# EAGLE design synth-zodiac-cancer-cv-panel (EAGLE 9.6.2)
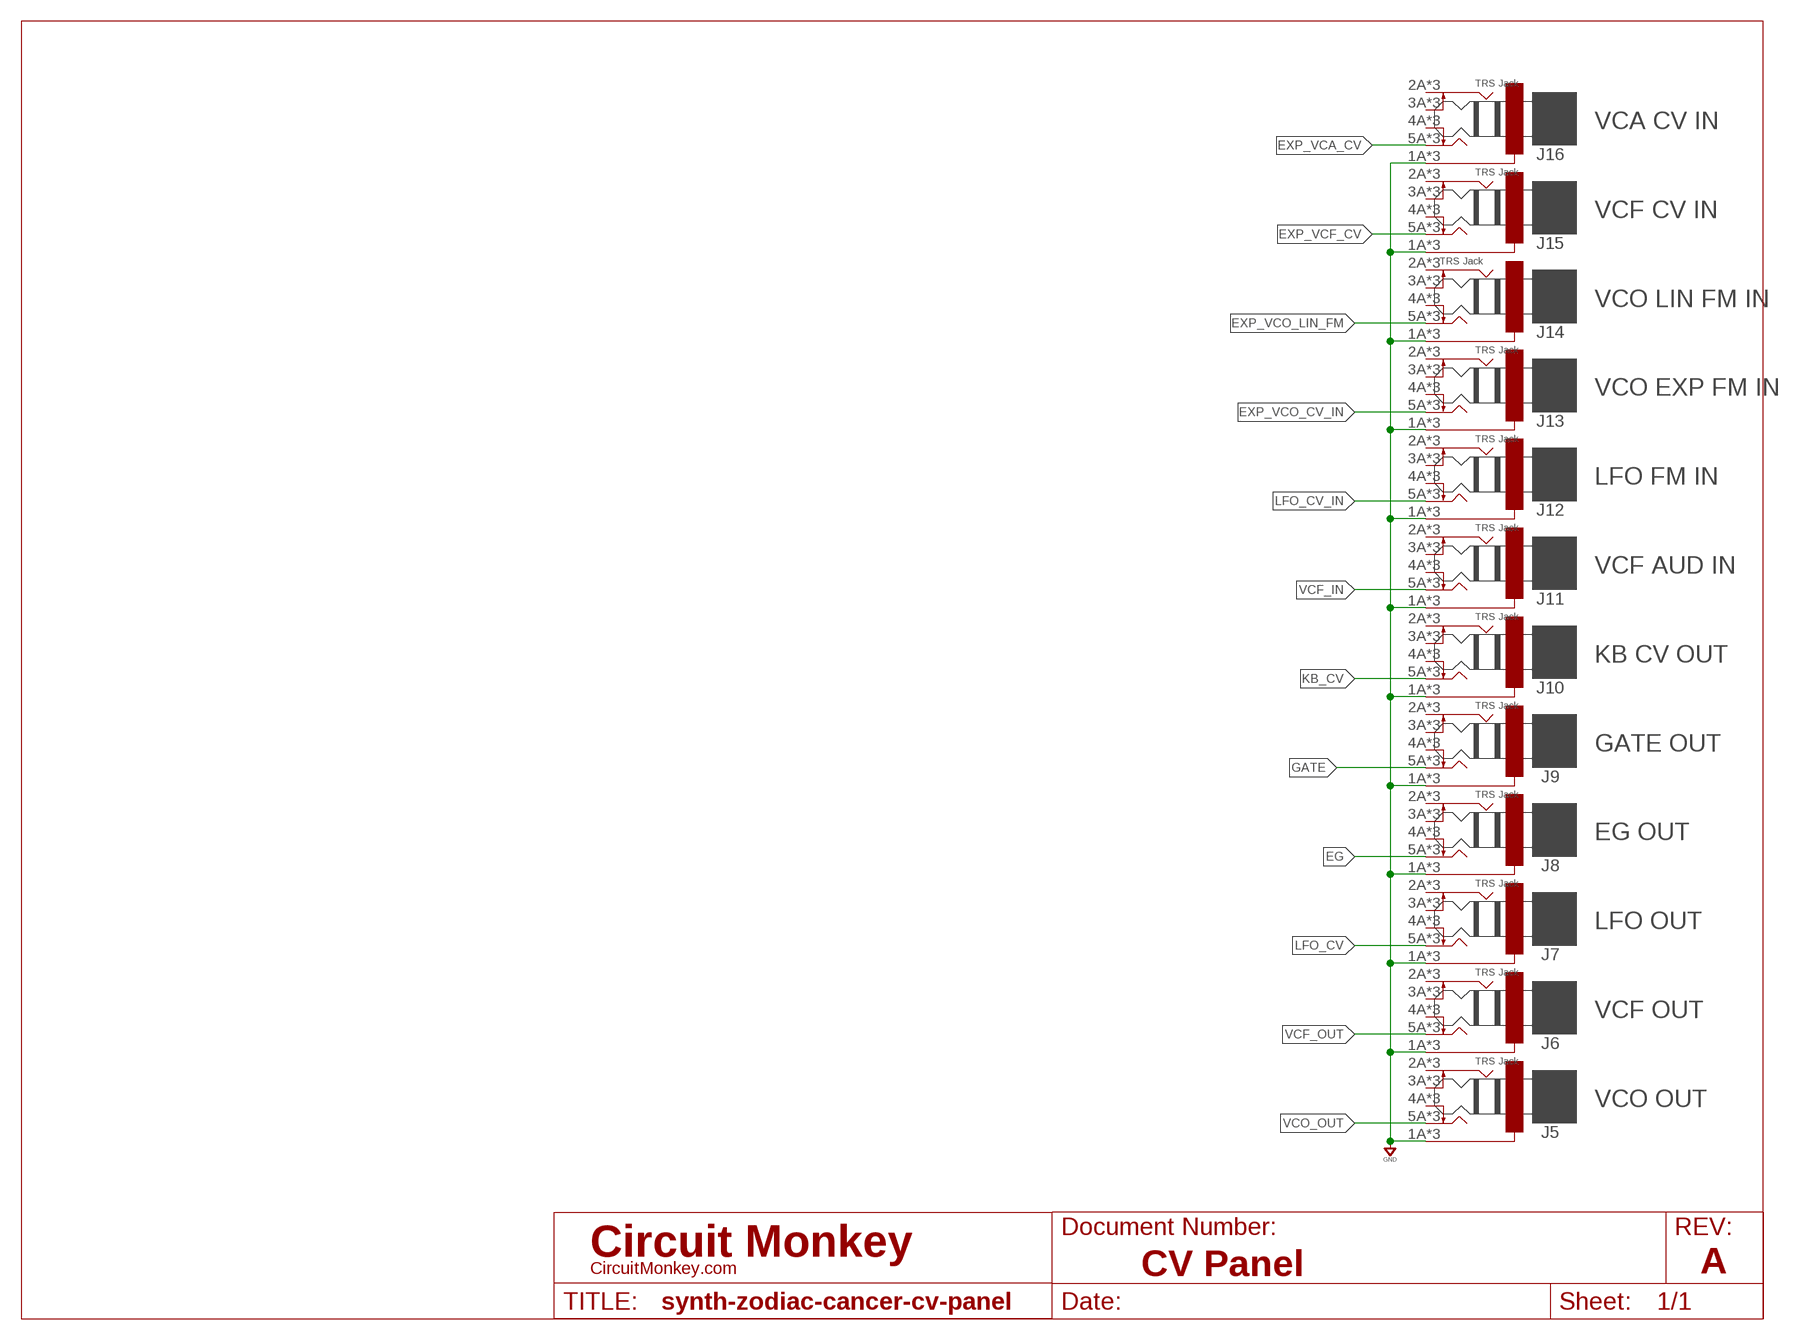
[diagram p0: schematic, sheet 1]
SHEET5 (LETTER_L-CIRCUITMONKEY): DOCUMENT_NUMBER: CV Panel; REV: A

## Parts
J5  TRS Jack  TRS-JACK-STEREOPJ-324  [PJ-324]
J6  TRS Jack  TRS-JACK-STEREOPJ-324  [PJ-324]
J7  TRS Jack  TRS-JACK-STEREOPJ-324  [PJ-324]
J8  TRS Jack  TRS-JACK-STEREOPJ-324  [PJ-324]
J9  TRS Jack  TRS-JACK-STEREOPJ-324  [PJ-324]
J10  TRS Jack  TRS-JACK-STEREOPJ-324  [PJ-324]
J11  TRS Jack  TRS-JACK-STEREOPJ-324  [PJ-324]
J12  TRS Jack  TRS-JACK-STEREOPJ-324  [PJ-324]
J13  TRS Jack  TRS-JACK-STEREOPJ-324  [PJ-324]
J14  TRS Jack  TRS-JACK-STEREOPJ-324  [PJ-324]
J15  TRS Jack  TRS-JACK-STEREOPJ-324  [PJ-324]
J16  TRS Jack  TRS-JACK-STEREOPJ-324  [PJ-324]

## Nets
EG: J8.5A1(T) J8.5A2(T) J8.5A(T)
EXP_VCA_CV: J16.5A1(T) J16.5A2(T) J16.5A(T)
EXP_VCF_CV: J15.5A1(T) J15.5A2(T) J15.5A(T)
EXP_VCO_CV_IN: J13.5A1(T) J13.5A2(T) J13.5A(T)
EXP_VCO_LIN_FM: J14.5A1(T) J14.5A2(T) J14.5A(T)
GATE: J9.5A1(T) J9.5A2(T) J9.5A(T)
GND: J5.1A1(S) J5.1A2(S) J5.1A(S) J6.1A1(S) J6.1A2(S) J6.1A(S) J7.1A1(S) J7.1A2(S) J7.1A(S) J8.1A1(S) J8.1A2(S) J8.1A(S) J9.1A1(S) J9.1A2(S) J9.1A(S) J10.1A1(S) J10.1A2(S) J10.1A(S) J11.1A1(S) J11.1A2(S) J11.1A(S) J12.1A1(S) J12.1A2(S) J12.1A(S) J13.1A1(S) J13.1A2(S) J13.1A(S) J14.1A1(S) J14.1A2(S) J14.1A(S) J15.1A1(S) J15.1A2(S) J15.1A(S) J16.1A1(S) J16.1A2(S) J16.1A(S)
KB_CV: J10.5A1(T) J10.5A2(T) J10.5A(T)
LFO_CV: J7.5A1(T) J7.5A2(T) J7.5A(T)
LFO_CV_IN: J12.5A1(T) J12.5A2(T) J12.5A(T)
VCF_IN: J11.5A1(T) J11.5A2(T) J11.5A(T)
VCF_OUT: J6.5A1(T) J6.5A2(T) J6.5A(T)
VCO_OUT: J5.5A1(T) J5.5A2(T) J5.5A(T)
Unconnected: J5.2A1(R) J5.2A2(R) J5.2A(R) J5.3A1(RN) J5.3A2(RN) J5.3A(RN) J5.4A1(TN) J5.4A2(TN) J5.4A(TN) J6.2A1(R) J6.2A2(R) J6.2A(R) J6.3A1(RN) J6.3A2(RN) J6.3A(RN) J6.4A1(TN) J6.4A2(TN) J6.4A(TN) J7.2A1(R) J7.2A2(R) J7.2A(R) J7.3A1(RN) J7.3A2(RN) J7.3A(RN) J7.4A1(TN) J7.4A2(TN) J7.4A(TN) J8.2A1(R) J8.2A2(R) J8.2A(R) J8.3A1(RN) J8.3A2(RN) J8.3A(RN) J8.4A1(TN) J8.4A2(TN) J8.4A(TN) J9.2A1(R) J9.2A2(R) J9.2A(R) J9.3A1(RN) J9.3A2(RN) J9.3A(RN) J9.4A1(TN) J9.4A2(TN) J9.4A(TN) J10.2A1(R) J10.2A2(R) J10.2A(R) J10.3A1(RN) J10.3A2(RN) J10.3A(RN) J10.4A1(TN) J10.4A2(TN) J10.4A(TN) J11.2A1(R) J11.2A2(R) J11.2A(R) J11.3A1(RN) J11.3A2(RN) J11.3A(RN) J11.4A1(TN) J11.4A2(TN) J11.4A(TN) J12.2A1(R) J12.2A2(R) J12.2A(R) J12.3A1(RN) J12.3A2(RN) J12.3A(RN) J12.4A1(TN) J12.4A2(TN) J12.4A(TN) J13.2A1(R) J13.2A2(R) J13.2A(R) J13.3A1(RN) J13.3A2(RN) J13.3A(RN) J13.4A1(TN) J13.4A2(TN) J13.4A(TN) J14.2A1(R) J14.2A2(R) J14.2A(R) J14.3A1(RN) J14.3A2(RN) J14.3A(RN) J14.4A1(TN) J14.4A2(TN) J14.4A(TN) J15.2A1(R) J15.2A2(R) J15.2A(R) J15.3A1(RN) J15.3A2(RN) J15.3A(RN) J15.4A1(TN) J15.4A2(TN) J15.4A(TN) J16.2A1(R) J16.2A2(R) J16.2A(R) J16.3A1(RN) J16.3A2(RN) J16.3A(RN) J16.4A1(TN) J16.4A2(TN) J16.4A(TN)

## Notes on the sheet
- VCA CV IN
  
  VCF CV IN
  
  VCO LIN FM IN
  
  VCO EXP FM IN
  
  LFO FM IN
  
  VCF AUD IN
  
  KB CV OUT
  
  GATE OUT
  
  EG OUT
  
  LFO OUT
  
  VCF OUT
  
  VCO OUT

## Library data of the parts
J5-J16 = con-trs:TRS-JACK-STEREO: TRS Jack; COST01: 0.18; COST10: 0.18; COST100: 0.18; MFR: Tayda; MPN: A-4780

## Board
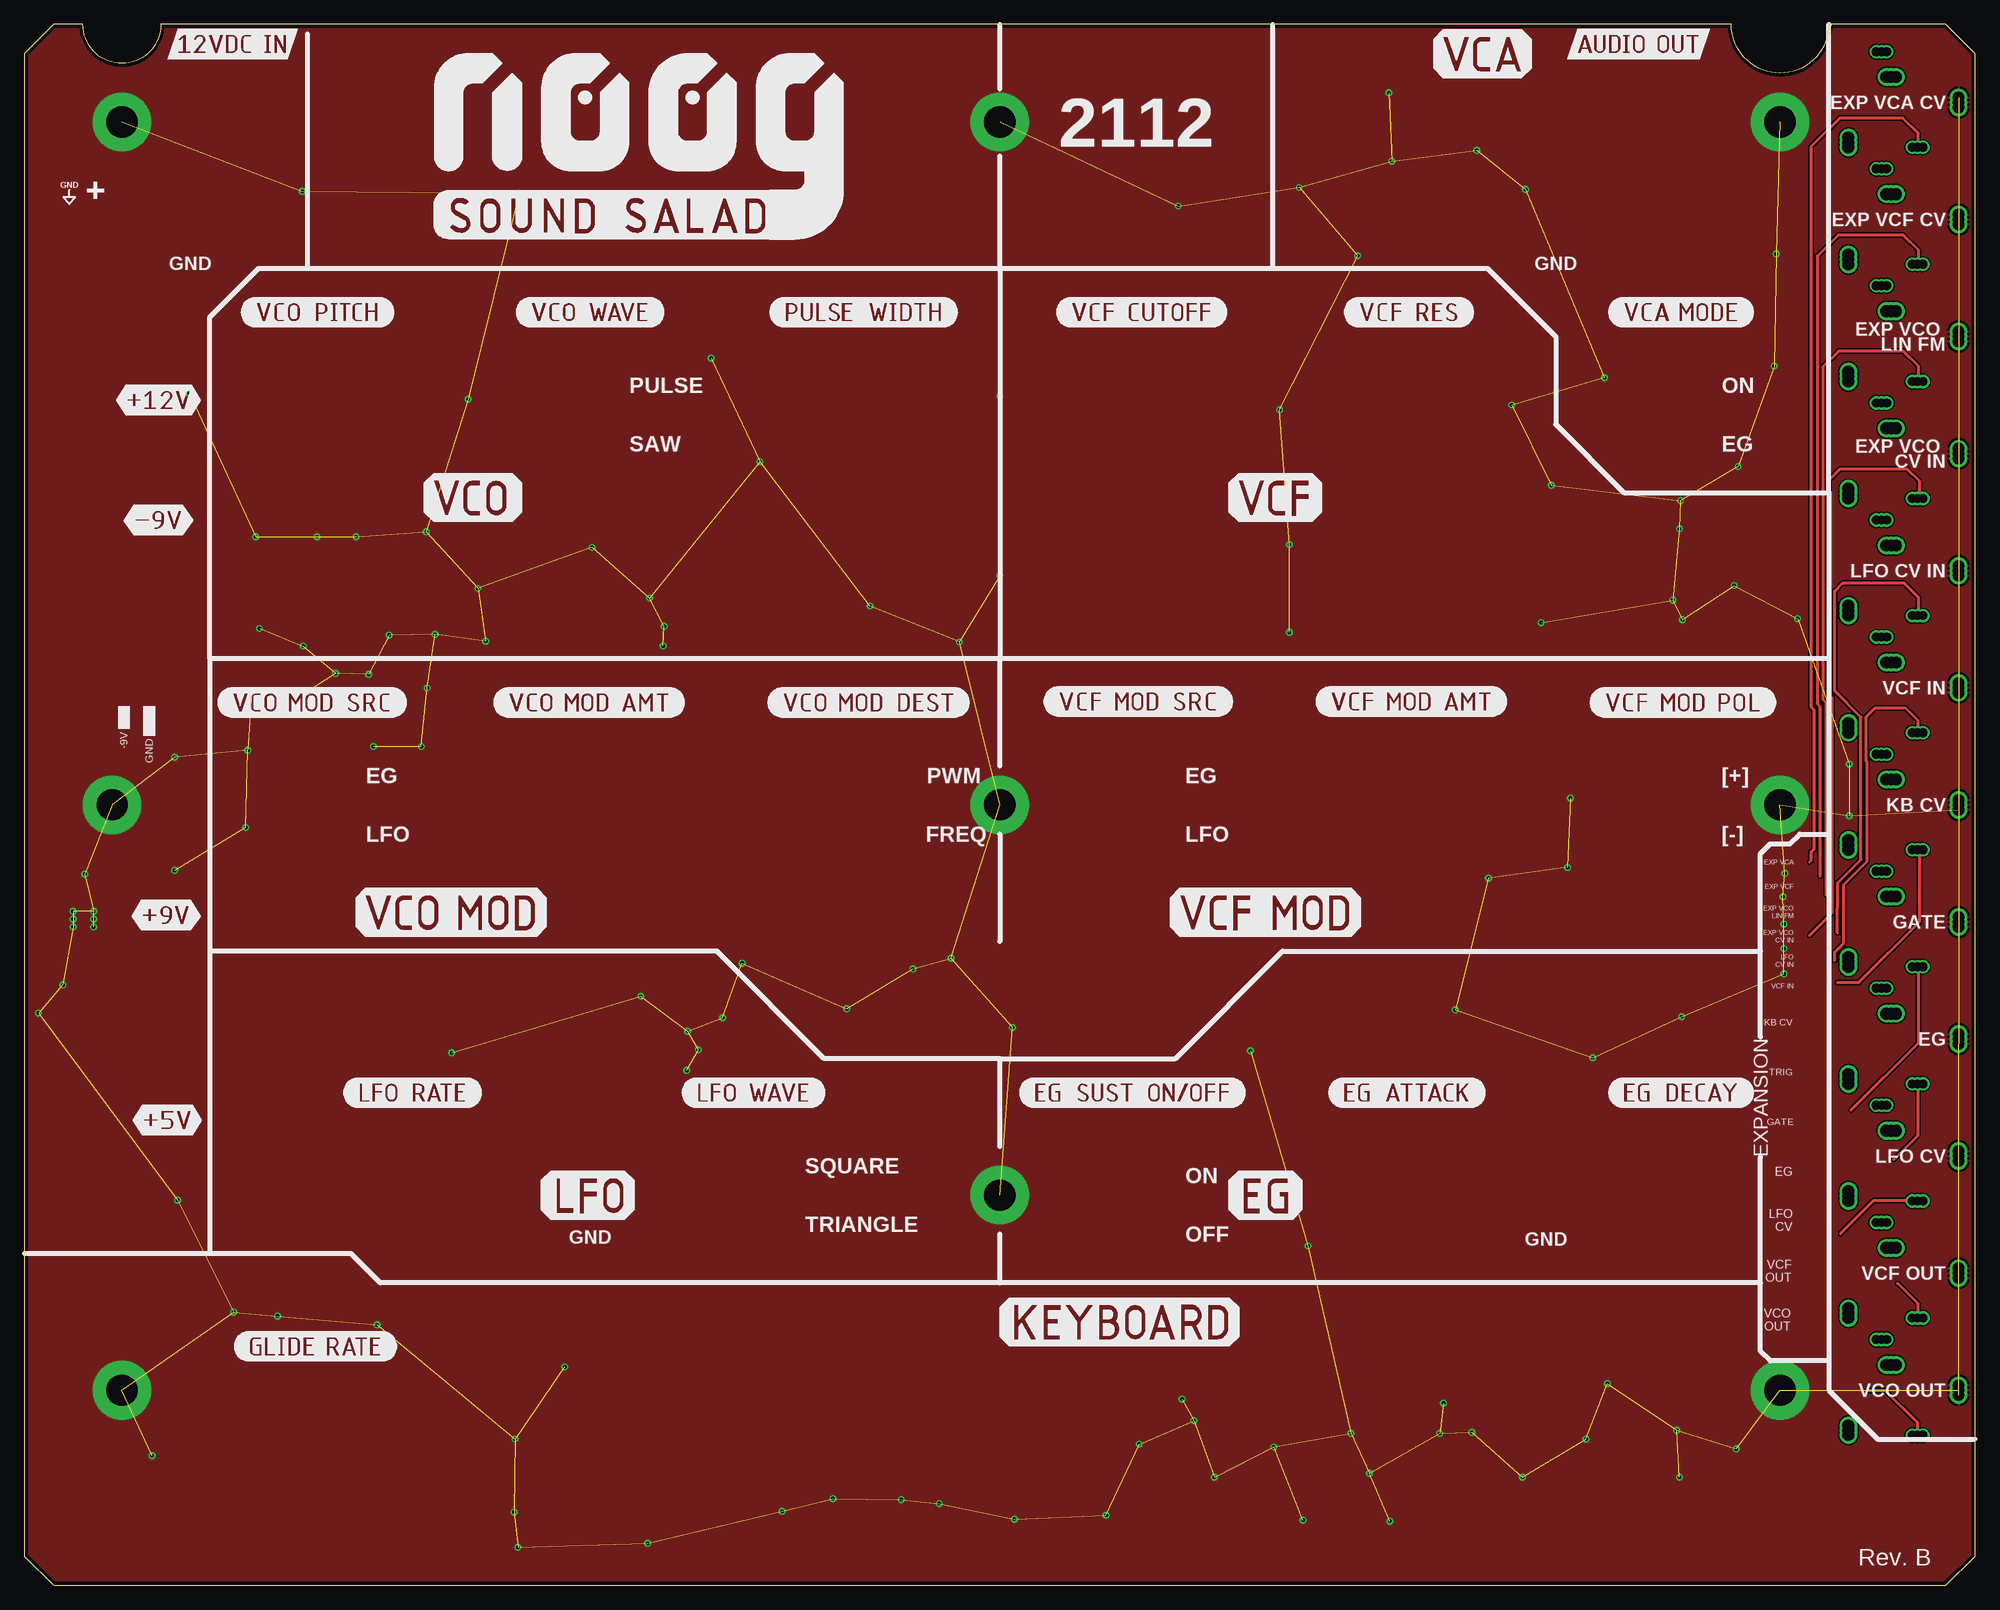
[diagram p1: board, top side]
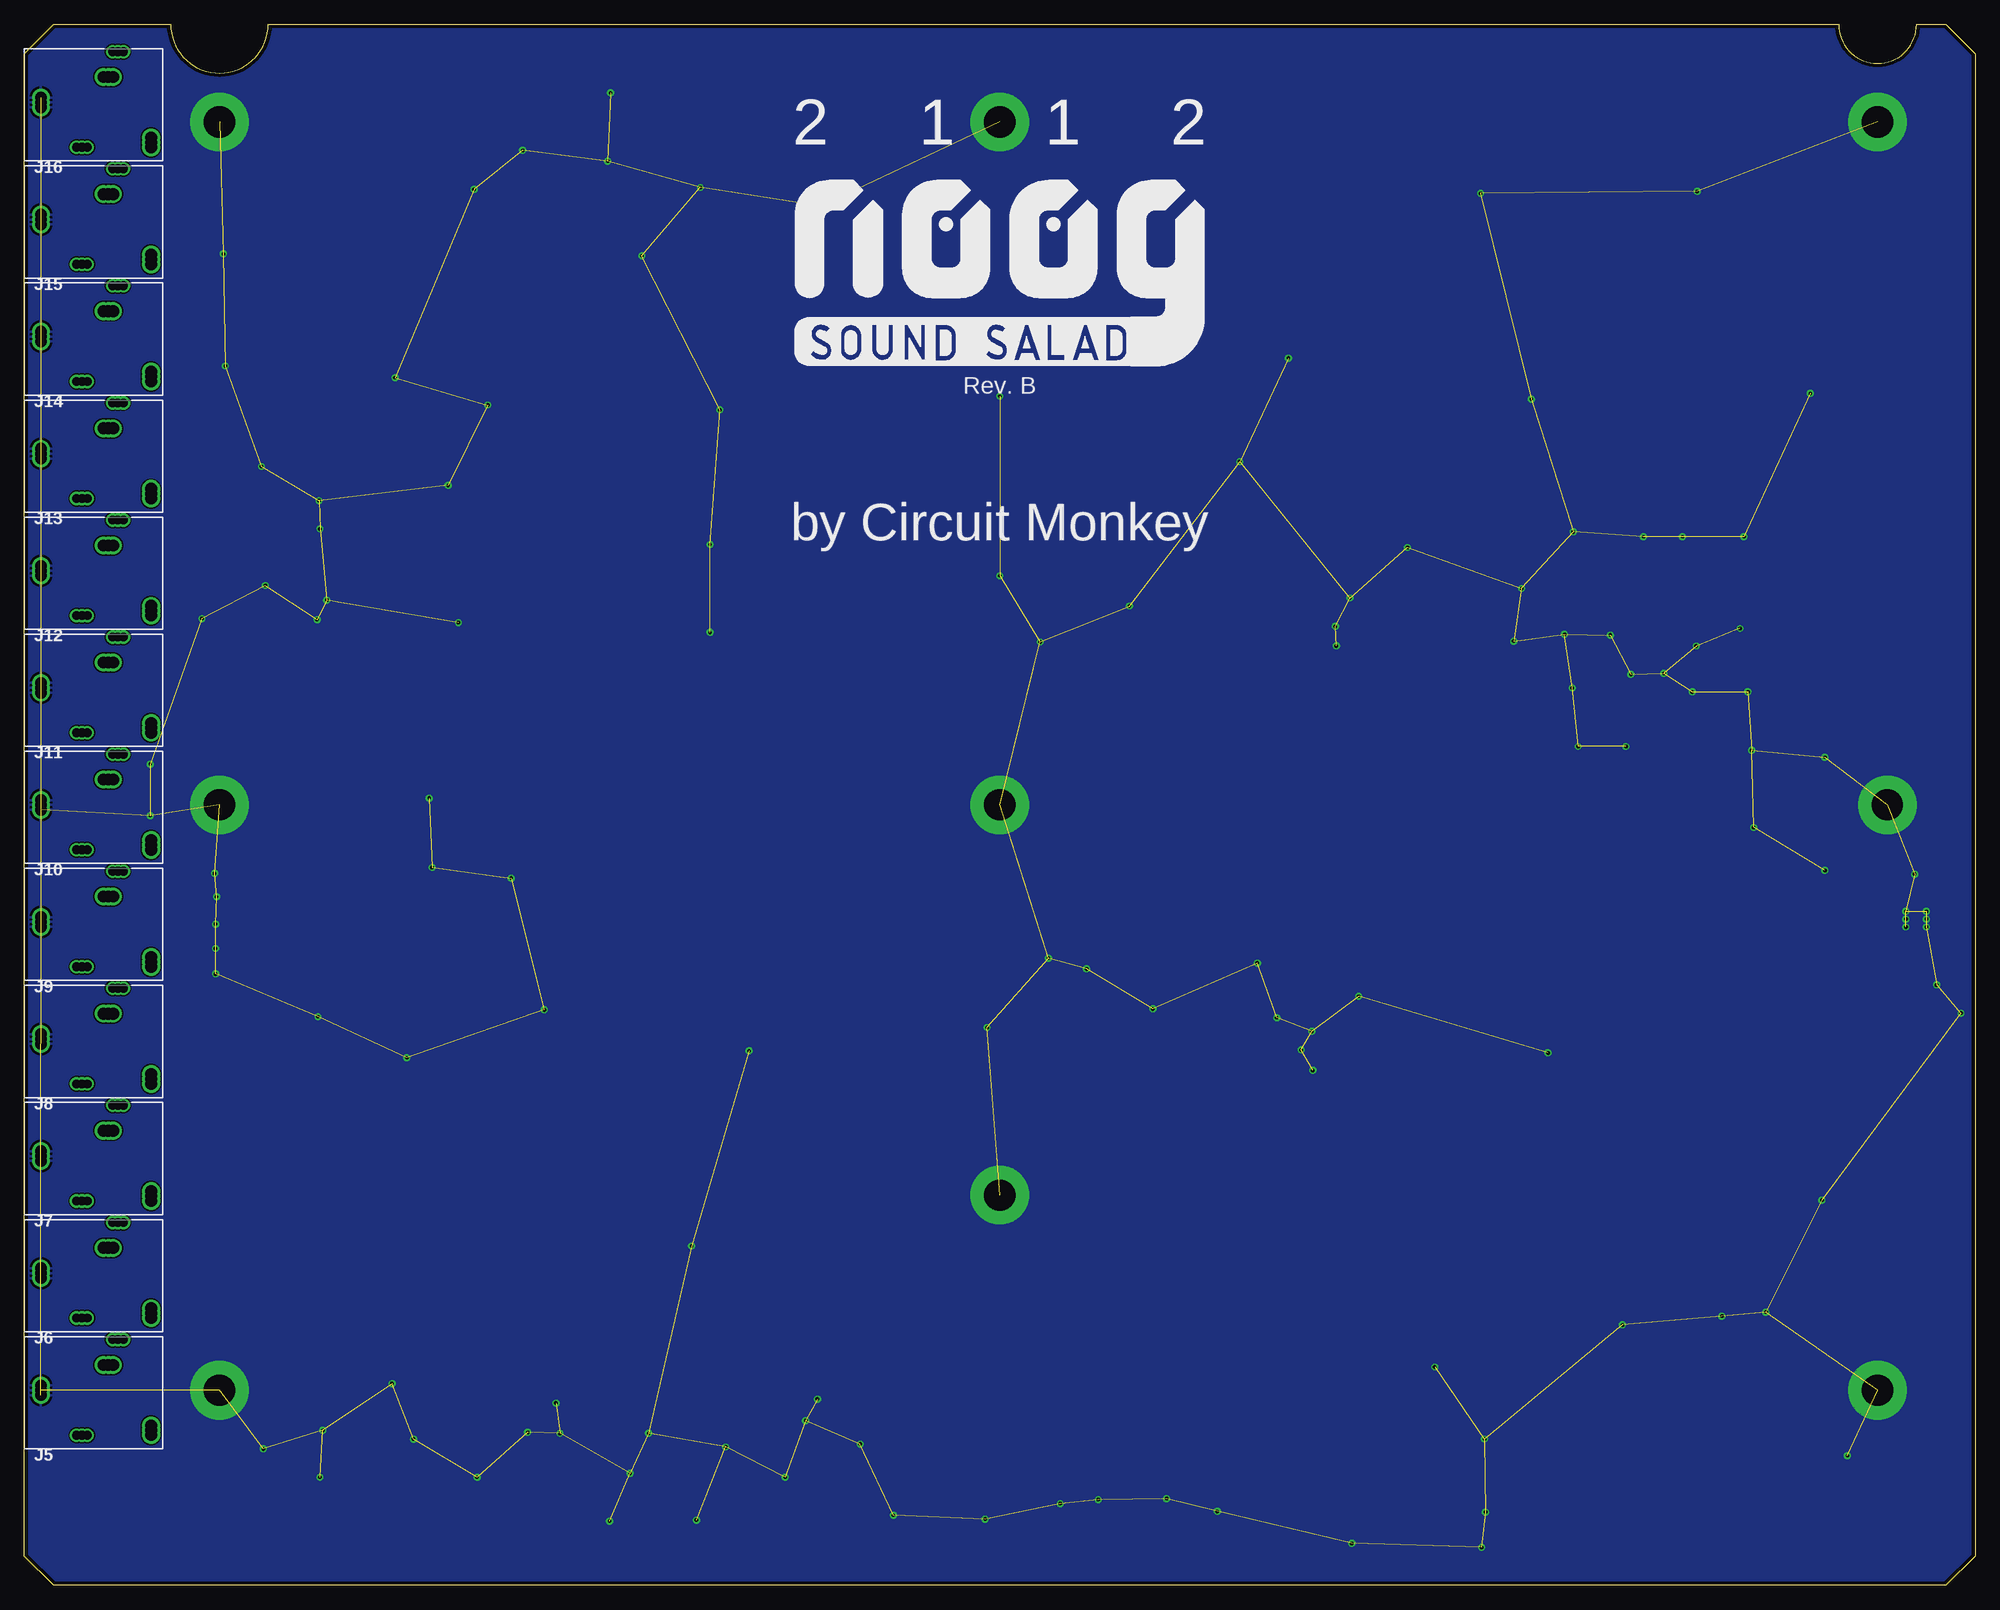
[diagram p2: board, bottom side, seen from below]

Size 200 x 160 mm. Coordinates in mm from the lower left corner, seen from the top.
Outline: 3,0 197,0 200,3 200,157 197,160 185,160 arc-90 180,155 arc-90 175,160 14,160 arc-90 10,156 arc-90 6,160 3,160 0,157 0,3 3,0
Copper layers (1*16): Top 0.0356mm / dielectric 1.5011mm / Bottom 0.0356mm
Design rules "OSH-CircuitMonkey *": minimum track width 6mil, minimum drill 13mil, track to track 6mil, track to pad 6mil, pad to pad 6mil, via to via 6mil, smd to smd 6mil, copper to edge 15mil, drill to drill 6mil, minimum pad ring 7mil, minimum via ring 7mil, stop-mask expansion 3mil, vias tented up to drill 15mil, thermal gap 10mil

### Footprints (pad centres in the part's own frame; a part is rotated, then mirrored left to right if it is on the bottom)
PJ-324 = drill 1.2: 1A 0,-1.7; 1A1 -0.5,-1.7; 1A2 0.5,-1.7; 3A 2.6,-8.6; 3A1 2.6,-8.1; 3A2 2.6,-9.1; 4A -4.1,-13; 4A1 -4.6,-13; 4A2 -3.6,-13 | drill 0.9: 2A 5.2,-9.6; 2A1 5.2,-9.05; 2A2 5.2,-10.15; 5A -4.6,-5.9; 5A1 -4.6,-5.35; 5A2 -4.6,-6.45

### Placement (x,y rotation side)
J5  200,20 90 bottom
J6  200,32 90 bottom
J7  200,44 90 bottom
J8  200,56 90 bottom
J9  200,68 90 bottom
J10  200,80 90 bottom
J11  200,92 90 bottom
J12  200,104 90 bottom
J13  200,116 90 bottom
J14  200,128 90 bottom
J15  200,140 90 bottom
J16  200,152 90 bottom

### Tracks (layer width: path | path; a pad name or v marks a point on that pad's centre or on a via)
EG
  Top 0.3: 191.65,43.65 194.1,46.1 J8.5A J8.5A1 J8.5A2
EXP_VCA_CV
  Top 0.3: J16.5A 194.1,148.9 192.6,150.4 186.1,150.4 183.2,147.5 183.2,90 183.5,89.7 183.5,75.5 183.2,75.2 183.2,74.33 183,74.13 | J16.5A J16.5A2 | J16.5A J16.5A1
EXP_VCF_CV
  Top 0.3: 184.1,72.69 184.1,90.1 183.8,90.4 183.8,136.25 185.95,138.4 192.65,138.4 194.15,136.9 194.15,135.4 J15.5A1 J15.5A2 J15.5A
EXP_VCO_CV_IN
  Top 0.3: 183,66.6 185.3,68.9 185.3,91 185,91.3 185,113.25 186.15,114.4 193.05,114.4 194.25,113.2 194.25,111.4 J13.5A1 | J13.5A1 J13.5A2 | J13.5A J13.5A1
EXP_VCO_LIN_FM
  Top 0.3: 184.7,70.75 184.7,90.5 184.39,90.81 184.4,124.9 186,126.5 192.65,126.5 194.15,125 194.15,123.4 J14.5A1 J14.5A J14.5A2
GATE
  Top 0.3: 187.3,48.73 194.15,55.58 194.15,62.9 J9.5A1 J9.5A J9.5A2
GND  (via drill 0.35, 3.2 pad 6)  (171 unrouted)
  other vias: 10,150 10,20 180,20 180,150 9,80 180,80 100,80 100,150 1.45,58.65 3.95,61.55 6.2,72.9 65.6,98.3 100,40 71.6,58.18 69.1,54.88 68,56.78 67.9,52.78 43.8,54.58 84.3,59.08 95,64.28 101.3,57.18 91.1,63.18 73.6,63.78 128.1,14.18 118.7,19.08 119.9,16.88 114.3,14.48 145.1,15.58 148.4,15.68 136,15.58 160.1,14.98 175.5,13.98 169.4,15.88 169.7,11.08 153.6,11.08 162.3,20.68 137.9,11.48 122,11.08 110.9,7.18 93.8,8.38 101.5,6.78 89.9,8.78 82.9,8.88 77.7,7.58 55.4,22.38 13.1,13.28 15.7,39.48 187.1,84.18 187.1,78.88 180.5,72.98 180.3,70.58 180.4,67.78 180.4,65.28 180.4,62.68 155.5,98.68 129.7,106.68 129.7,97.68 128.7,120.48 100,121.88 100,103.48 86.7,100.38 75.4,115.18 70.4,125.78 45.5,121.58 58.2,106.38 47.3,96.78 46.5,102.18 42.1,97.48 41.2,107.98 34,107.48 30,107.48 23.7,107.48 24.1,98.08 16.9,122.18 28.5,142.88 50.7,142.68 118.3,141.38 130.7,143.28 140.2,145.98 139.9,152.98 148.9,147.08 153.9,143.08 162,123.78 152.5,120.98 179.4,124.98 179.6,136.48 169.7,108.28 170,98.98 181.8,99.08 158.5,80.68 158.2,73.58 150.1,72.48 169.9,58.28 146.7,58.98 125.7,54.78 131.6,34.78 145.5,18.68 140,6.58 131.1,6.68 63.9,4.3 50.6,3.9 50.3,15 50.2,7.5 25.95,27.6 36.15,26.7 21.45,28 63.2,60.38 37.4,97.4 169.8,111.18 175.7,114.68 95.85,96.7 23.3,91.58 29,91.58 28.6,96.28 31.9,93.48 35.3,93.38 41.3,91.98 40.7,85.98 35.8,85.98 22.9,85.58 22.7,77.68 15.4,84.88 15.4,73.28 7.1,69.08 7.1,68.28 7.1,67.48 5,68.28 5,67.48 5,69.08 65.5,96.3 64.1,101.2 156.55,112.75 136.7,136.28 175.3,102.48 169,100.98 160.8,54.08
  pour Bottom: 0,0 0,160 200,160 200,0
  pour Top: 0,0 0,160 200,160 200,0
KB_CV
  Top 0.3: 185.91,61.8 188.1,61.8 194.25,67.95 194.25,75 J10.5A1 | J10.5A J10.5A1 | J10.5A1 J10.5A2
LFO_CV
  Top 0.3: 186.2,36.03 189.57,39.4 J7.5A | J7.5A1 J7.5A | J7.5A J7.5A2
LFO_CV_IN
  Top 0.3: 185.87,66.84 185.9,72 188.3,74.4 188.3,89 185.6,91.7 185.6,101.9 186.4,102.7 192.75,102.7 194.15,101.3 194.15,99.4 J12.5A1 J12.5A J12.5A2
VCF_IN
  Top 0.3: 185.6,64.03 185.6,64.9 186.52,65.82 186.52,71.79 188.9,74.17 188.9,84.4 188.8,84.5 188.8,89 189.7,89.9 192.9,89.9 194.1,88.7 J11.5A | J11.5A J11.5A2 | J11.5A1 J11.5A
VCF_OUT
  Top 0.3: 192.05,30.95 194.1,28.9 J6.5A | J6.5A J6.5A1 | J6.5A2 J6.5A
VCO_OUT
  Top 0.3: J5.5A 194.1,16.67 190.8,19.97 188.9,19.97 | J5.5A J5.5A1 | J5.5A2 J5.5A

### Text on the board
tPlace: EXP VCA CV | 2112 | GND | + | EXP VCF CV | GND | GND | EXP VCO / LIN FM | PULSE | ON | SAW | EG | EXP VCO / CV IN | LFO CV IN | VCF IN | -9V | GND | EG | PWM | EG | [+] | KB CV | LFO | FREQ | LFO | [-] | EXP VCA | EXP VCF | EXP VCO / LIN FM | GATE | EXP VCO / CV IN | LFO / CV IN | VCF IN | KB CV | EG | TRIG | EXPANSION | GATE | LFO CV | SQUARE | ON | EG | TRIANGLE | LFO / CV | OFF | GND | GND | VCF / OUT | VCF OUT | VCO / OUT | VCO OUT | Rev. B
bPlace: 2 1 1 2 | Rev. B | by Circuit Monkey
tDocu: noog